# Altium schematic sheet Cell_Volt_Comparator.SchDoc
size A4; Organization: TESLA Motors, INC; Address1: 3500 Deer Creek Road; Address2: Palo Alto, CA; Address4: U.S.A.; SheetNumber: 4; SheetTotal: 8
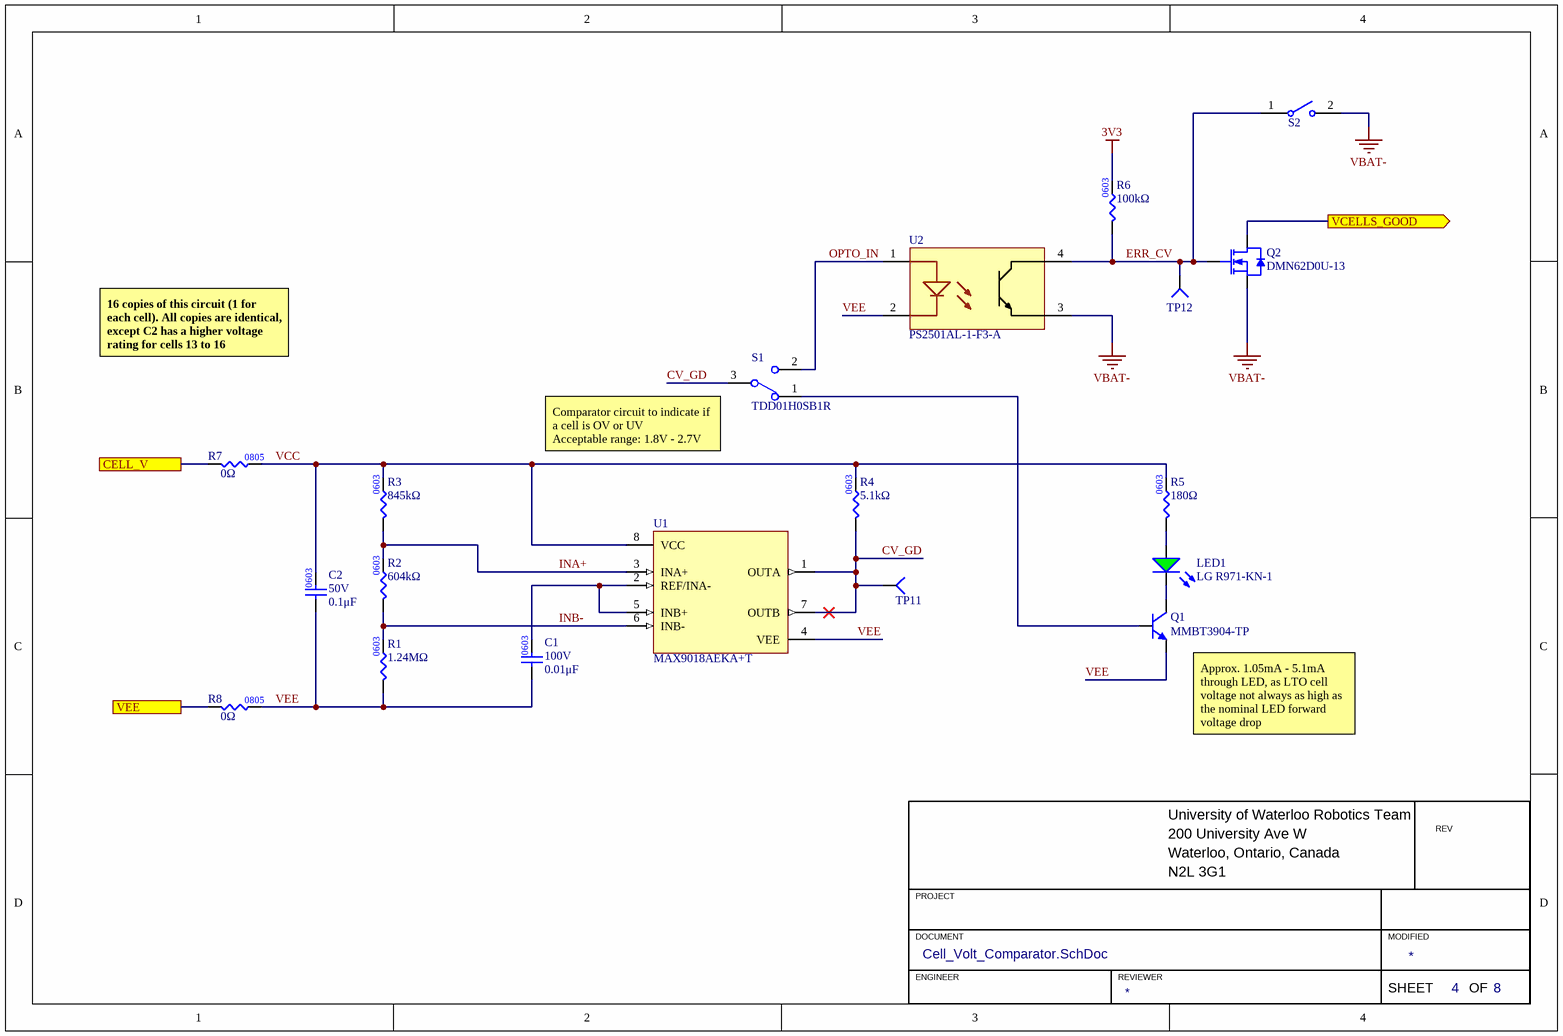
[diagram p0: Cell_Volt_Comparator.SchDoc]

## Parts
C1  value 0.01μF  Voltage Rating: 100V  [CAP0603]  (hidden comment: CAP_0.01uF_100V_0603)
C2  value 0.1μF  Voltage Rating: 50V  [CAP0603]  (hidden comment: CAP_0.1uF_50V_0603)
LED1  Manufacturer Part Number 1: LG R971-KN-1  [LED_0805_GREEN]  (hidden comment: LED_GREEN)
Q1  Manufacturer Part Number 1: MMBT3904-TP  [SOT23-3]  (hidden comment: NPN_40V_100mA)
Q2  Manufacturer Part Number 1: DMN62D0U-13  [NMOS_SSOT-3]  (hidden comment: NMOS_60V_380mA)
R1  value 1.24MΩ  [RES0603]  (hidden comment: RES_1.24MΩ_0603_1%)
R2  value 604kΩ  [RES0603]  (hidden comment: RES_604kΩ_0603_1%)
R3  value 845kΩ  [RES0603]  (hidden comment: RES_845kΩ_0603_1%)
R4  value 5.1kΩ  [RES0603]  (hidden comment: RES_5.1kΩ_0603_1%)
R5  value 180Ω  [RES0603]  (hidden comment: RES_180Ω_0603_1%)
R6  value 100kΩ  [RES0603]  (hidden comment: RES_100kΩ_0603_1%)
R7  value 0Ω  [RES0805]  (hidden comment: RES_0Ω_0805)
R8  value 0Ω  [RES0805]  (hidden comment: RES_0Ω_0805)
S1  Manufacturer Part Number 1: TDD01H0SB1R  [TDD01_SPDT]  (hidden comment: SW_SLIDE_SPDT_SMD)
S2  SW_SLIDE_SPST_SMD  [SDA01_SPST]  (value not drawn)
TP11  TESTPOINT_1MM_CIRCLE  [TESTPOINT_CIRCLE_1MM]  (value not drawn)  (no BOM)
TP12  TESTPOINT_1MM_CIRCLE  [TESTPOINT_CIRCLE_1MM]  (value not drawn)  (no BOM)
U1  Manufacturer Part Number 1: MAX9018AEKA+T  [SOT23-8 MAXIM]  (hidden comment: IC_COMPARATOR_MAX9018)
U2  Manufacturer Part Number 1: PS2501AL-1-F3-A  [DIP-4L_REN]  (hidden comment: OPTOCOUPLER_PS2501AL-1-F3-A)

## Ports
CELL_V, VCELLS_GOOD (out), VEE

## Nets
3V3: R6.2
VBAT-: Q2.2(SOURCE) S2.2 U2.3(Emitter)
CELL_V: R7.1 ; port CELL_V
CV_GD: R4.1 S1.3 TP11.1(=value) U1.1(OUTA) U1.7(OUTB)
ERR_CV: Q2.1(GATE) R6.1 S2.1 TP12.1(=value) U2.4(Collector)
INA+: R2.2 R3.1 U1.3(INA+)
INB-: R1.2 R2.1 U1.6(INB-)
OPTO_IN: S1.2 U2.1(Anode)
VCC: C2.2 R3.2 R4.2 R5.2 R7.2 U1.8(VCC)
VCELLS_GOOD: Q2.3(DRAIN) ; port VCELLS_GOOD
VEE: C1.1 C2.1 Q1.2(E) R1.1 R8.2 U1.4(VEE) U2.2(Cathode)
VEE: R8.1 ; port VEE  [a separate net that carries the same name]
NetC1_2: C1.2 U1.2(REF/INA-) U1.5(INB+)
NetLED1_1: LED1.1(A) R5.1
NetLED1_2: LED1.2(K) Q1.3(C)
NetQ1_1: Q1.1(B) S1.1

## Notes on the sheet
- 16 copies of this circuit (1 for each cell). All copies are identical, except C2 has a higher voltage rating for cells 13 to 16
- (near S1) Comparator circuit to indicate if a cell is OV or UV
  Acceptable range: 1.8V - 2.7V
- (near Q1) Approx. 1.05mA - 5.1mA through LED, as LTO cell voltage not always as high as the nominal LED forward voltage drop
- University of Waterloo Robotics Team
- 200 University Ave W
- REV
- PROJECT
- Waterloo, Ontario, Canada
- N2L 3G1
- DOCUMENT
- ENGINEER
- REVIEWER
- MODIFIED
- SHEET
- OF
- (in symbol CAP_0.01uF_100V_0603) 0603
- (in symbol RES_100kΩ_0603_1%) 0603
- (in symbol RES_180Ω_0603_1%) 0603
- (in symbol RES_604kΩ_0603_1%) 0603
- (in symbol RES_845kΩ_0603_1%) 0603

## Library data of the parts
C1 = CAP_0.01uF_100V_0603: CAP CER 0.01uF 100V X7R 0603; Manufacturer Part Number 1: GCM188R72A103KA37J; Manufacturer 1: Murata Electronics; Supplier Part Number 1: 490-8028-1-ND; Supplier 1: Digi-Key; Dielectric: X7R
C2 = CAP_0.1uF_50V_0603: CAP CER 0.1UF 50V X7R 0603; Manufacturer Part Number 1: CC0603KRX7R9BB104; Manufacturer 1: Yageo; Package/Footprint: 0603; Supplier Part Number 1: 311-1344-1-ND; Supplier 1: Digi-Key; Mounting Type: SMD; Dielectric: X7R
LED1 = LED_GREEN: LED GREEN DIFFUSED 0805 SMD; Manufacturer 1: OSRAM; Forward Voltage Drop: 2.2V; Package/Footprint: 0805; Supplier Part Number 1: 475-1410-1-ND; Supplier 1: Digi-Key; Mounting Type: SMD
Q1 = NPN_40V_100mA: TRANS NPN 40V 0.2A SOT23; Manufacturer 1: Micro Commercial Co; Package: SOT-23-3; Supplier Part Number 1: MMBT3904TPMSCT-ND; Supplier 1: Digi-Key
Q2 = NMOS_60V_380mA: MOSFET N-CH 60V 380MA SOT23; Manufacturer 1: Diodes Incorporated; Vgs (Max): ±12V; Supplier 1: Digi-Key; Mounting Type: SMD; Package: SOT-23-3; Supplier Part Number 1: DMN62D0U-13DICT-ND; Id: 380mA; Vdss: 60V
R1 = RES_1.24MΩ_0603_1%: RES 1.24M OHM 1% 1/16W 0402; Manufacturer 1: Stackpole Electronics Inc; Manufacturer Part Number 1: RMCF0402FT1M24; Package: 0603; Supplier 1: Digi-Key; Supplier Part Number 1: RMCF0402FT1M24CT-ND
R2 = RES_604kΩ_0603_1%: RES 604K OHM 1% 1/10W 0603; Manufacturer 1: Yageo; Manufacturer Part Number 1: RC0603FR-07604KL; Supplier Part Number 1: 311-604KHRCT-ND; Supplier 1: Digi-Key
R3 = RES_845kΩ_0603_1%: RES 845K OHM 1% 1/10W 0603; Manufacturer 1: Yageo; Manufacturer Part Number 1: RC0603FR-07845KL; Supplier Part Number 1: 311-845KHRCT-ND; Supplier 1: Digi-Key
R4 = RES_5.1kΩ_0603_1%: RES 5.1K OHM 1% 1/10W 0603; Manufacturer 1: YAGEO; Manufacturer Part Number 1: RC0603FR-135K1L; Supplier Part Number 1: 13-RC0603FR-135K1LCT-ND; Supplier 1: Digi-Key; Mounting Type: SMD; Package: 0603
R5 = RES_180Ω_0603_1%: RES 180 OHM 1% 1/10W 0603; Manufacturer 1: Yageo; Manufacturer Part Number 1: RC0603FR-13180RL; Supplier Part Number 1: 13-RC0603FR-13180RLCT-ND; Supplier 1: Digi-Key
R6 = RES_100kΩ_0603_1%: RES 100K OHM 1% 1/10W 0603; Manufacturer 1: Yageo; Manufacturer Part Number 1: RC0603FR-07100KL; Supplier Part Number 1: 311-100KHRCT-ND; Supplier 1: Digi-Key
R7 R8 = RES_0Ω_0805: RES SMD 0 OHM JUMPER 1/2W 0805 (20A RATED); Manufacturer 1: Keystone Electronics; Manufacturer Part Number 1: 5106; Package/Footprint: 0805; Supplier Part Number 1: 36-5106CT-ND; Supplier 1: Digi-Key; Mounting Type: SMD
S1 = SW_SLIDE_SPDT_SMD: SWITCH SLIDE DIP SPDT 25MA 24V; Manufacturer 1: C&K; Voltage Rating: 24VDC; Supplier 1: Digi-Key; Supplier Part Number 1: CKN10546CT-ND
S2 = SW_SLIDE_SPST_SMD: SWITCH SLIDE DIP SPST 25MA 24V; Manufacturer 1: C&K; Manufacturer Part Number 1: SDA01H0SB; Voltage Rating: 24VDC; Supplier 1: Digi-Key; Supplier Part Number 1: CKN10914-ND
TP11 TP12 = TESTPOINT_1MM_CIRCLE: TESTPOINT 1MM CIRCLE
U1 = IC_COMPARATOR_MAX9018: IC COMPARATOR DUAL SOT23-8; Manufacturer 1: Analog Devices Inc./Maxim Integrated; Package/Footprint: SOT-23-8; Mounting Type: SMD; Supplier 1: Digi-Key; Supplier Part Number 1: MAX9018AEKA+TCT-ND
U2 = OPTOCOUPLER_PS2501AL-1-F3-A: OPTOISOLATOR 5KV TRANS 4SMD; Manufacturer 1: Renesas Electronics America Inc; Supplier 1: Digi-Key; Supplier Part Number 1: 559-1074-1-ND